# Altium schematic sheet 20.Power_DC IN.SchDoc
size 420 x 297 mm; Revision: V2.1; Schematic Page Number: 11; Page Number: 20; Check: Default; Schematic Name: RK_NVR_DEMO1_RK3588_LP4/4x_V21; Page Count: 43; Page name: 20.Power_DC IN; Designer: Zhangdz; Schematic Page Count: 99; Revcode: V2.1; DsnPath: E:\Work\SBER\RK3588_SOM\temp\RK_NVR_DEMO1_RK3588_LP4XD200P232SD8_V21_20211228.DSN; SchematicName: RK_NVR_DEMO1_RK3588_LP4/4x_V21; PageName: 20.Power_DC IN; PageSize: A3; TopSchematic: True
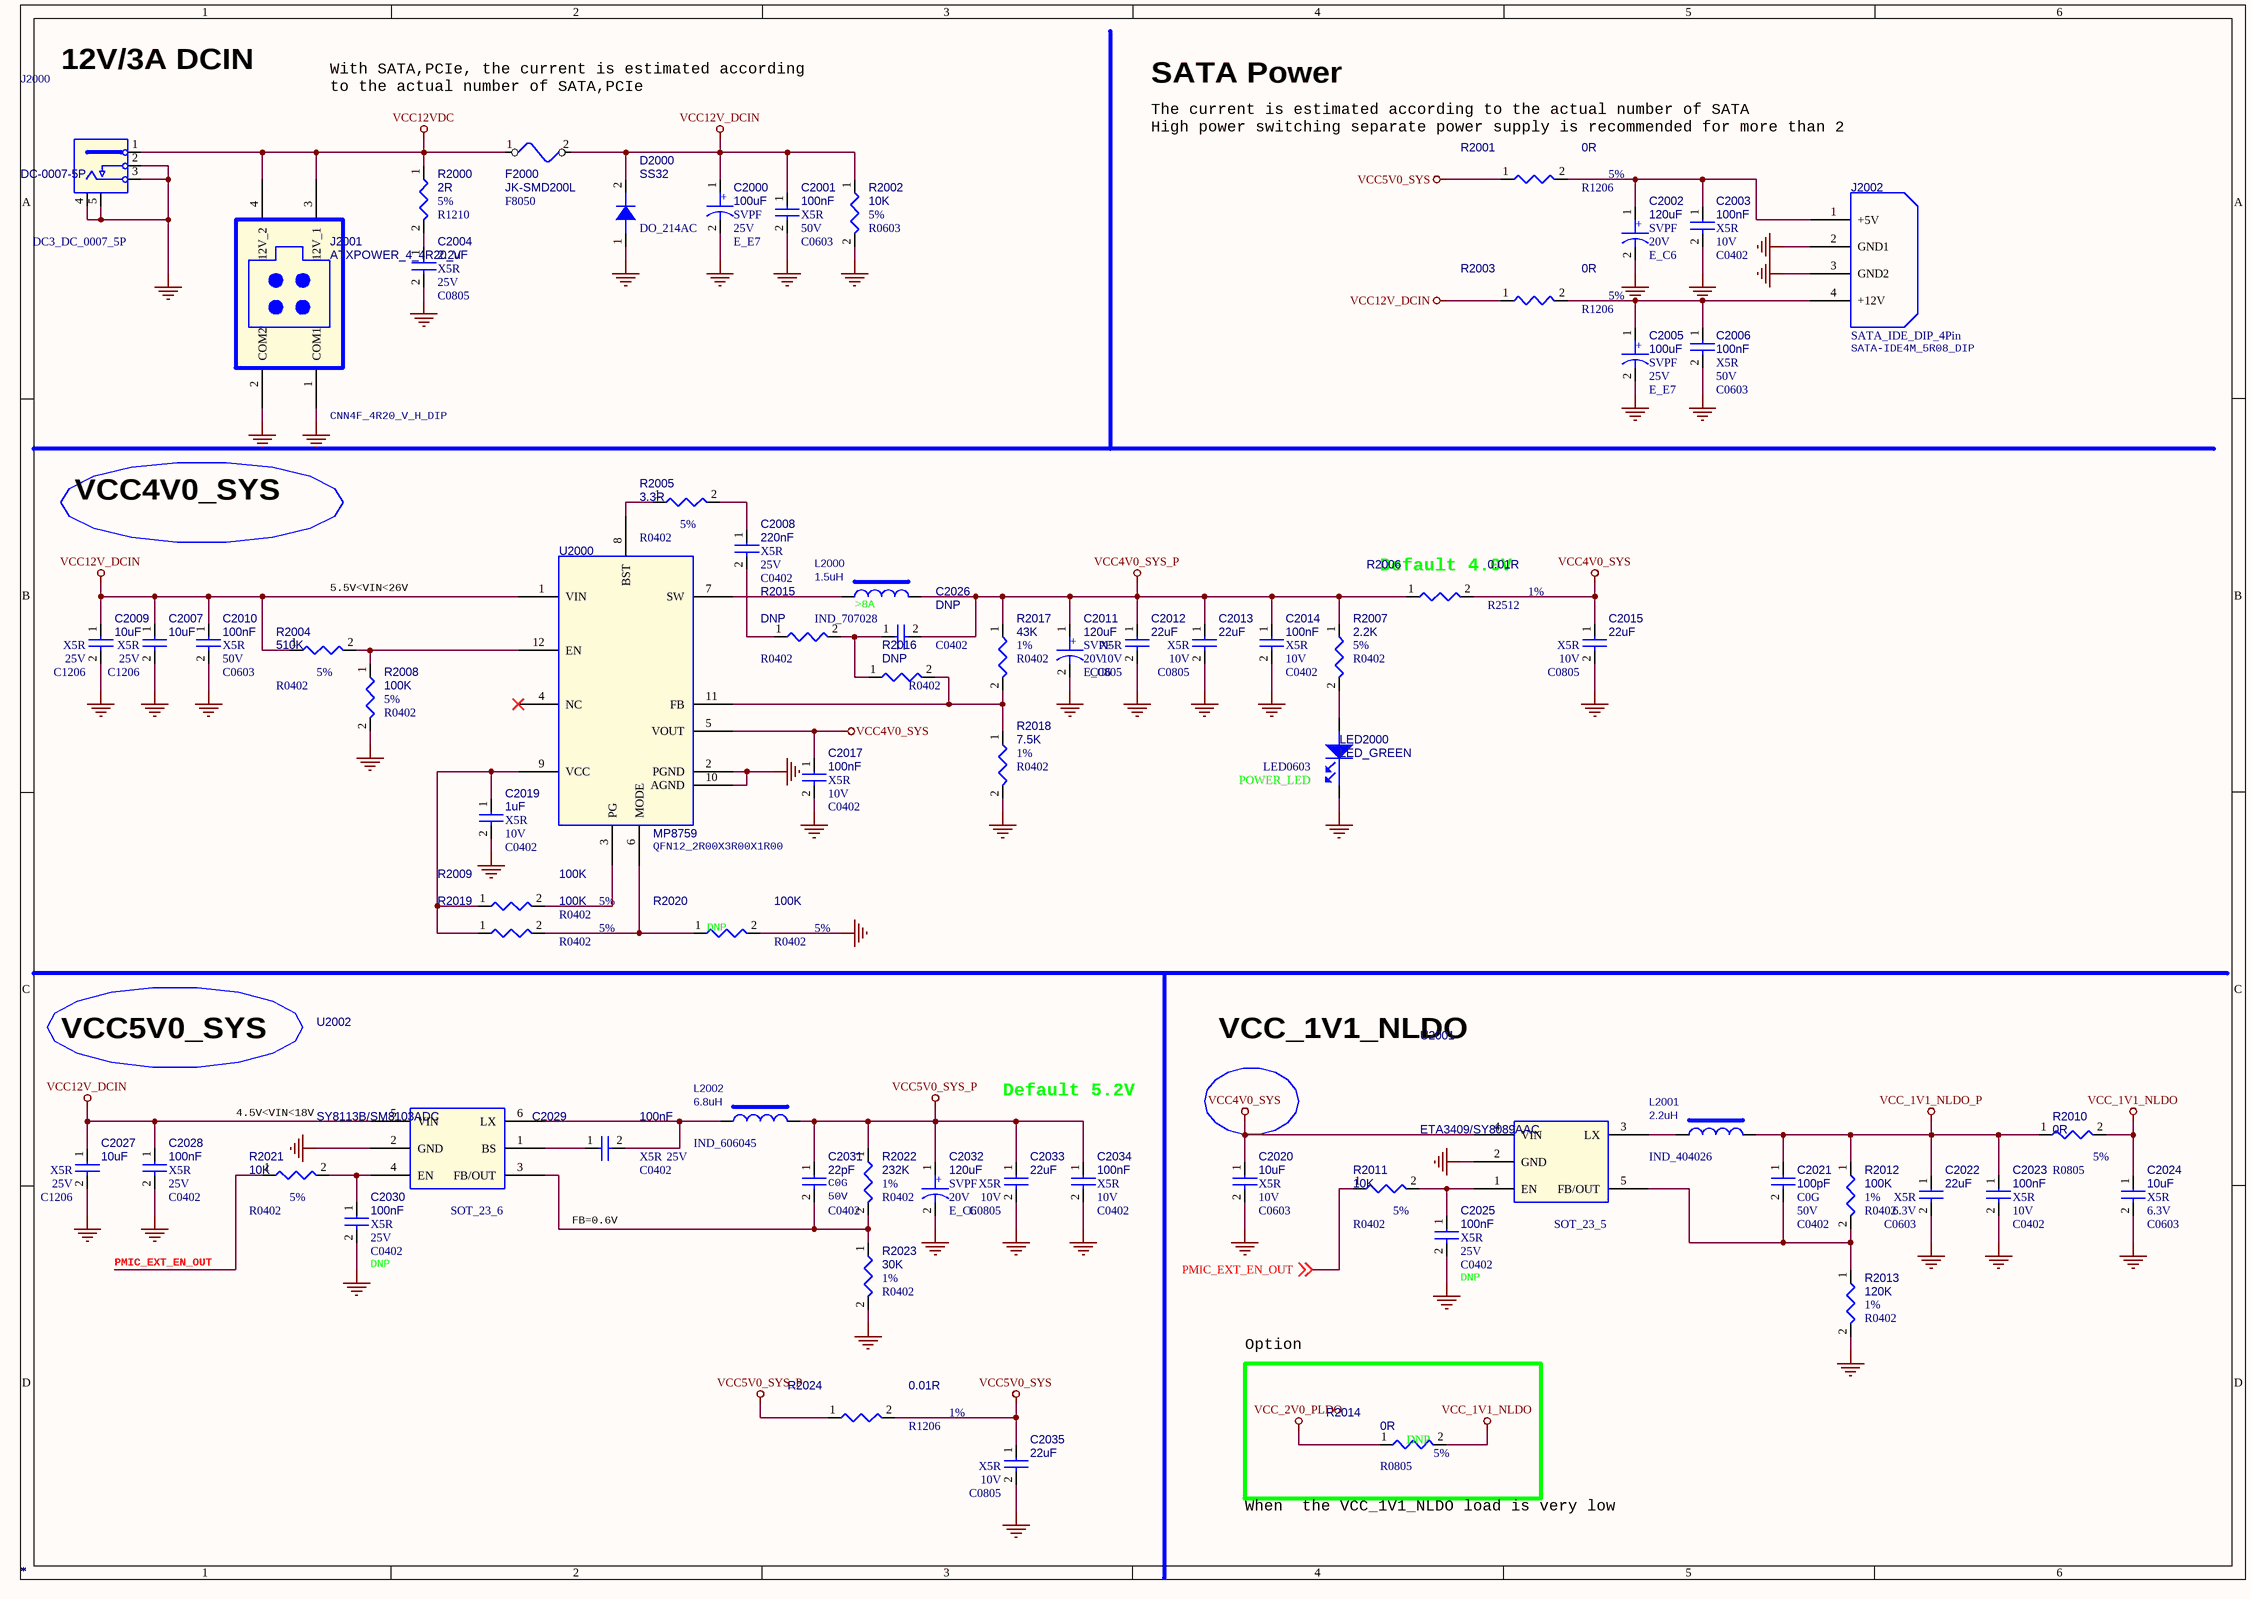
[diagram p0: 20.Power_DC IN.SchDoc]

## Parts
C2000  *  Voltage: 25V  Dielectric: SVPF  [E_E7]
C2001  *  Voltage: 50V  Dielectric: X5R  [C0603]
C2002  *  Voltage: 20V  Dielectric: SVPF  [E_C6]
C2003  *  Voltage: 10V  Dielectric: X5R  [C0402]
C2004  *  Voltage: 25V  Dielectric: X5R  [C0805]
C2005  *  Voltage: 25V  Dielectric: SVPF  [E_E7]
C2006  *  Voltage: 50V  Dielectric: X5R  [C0603]
C2007  *  Voltage: 25V  Dielectric: X5R  [C1206]
C2008  *  Voltage: 25V  Dielectric: X5R  [C0402]
C2009  *  Voltage: 25V  Dielectric: X5R  [C1206]
C2010  *  Voltage: 50V  Dielectric: X5R  [C0603]
C2011  *  Voltage: 20V  Dielectric: SVPF  [E_C6]
C2012  *  Voltage: 10V  Dielectric: X5R  [C0805]
C2013  *  Voltage: 10V  Dielectric: X5R  [C0805]
C2014  *  Voltage: 10V  Dielectric: X5R  [C0402]
C2015  *  Voltage: 10V  Dielectric: X5R  [C0805]
C2017  *  Voltage: 10V  Dielectric: X5R  [C0402]
C2019  *  Voltage: 10V  Dielectric: X5R  [C0402]
C2020  *  Voltage: 10V  Dielectric: X5R  [C0603]
C2021  *  Voltage: 50V  Dielectric: C0G  [C0402]
C2022  *  Voltage: 6.3V  Dielectric: X5R  [C0603]
C2023  *  Voltage: 10V  Dielectric: X5R  [C0402]
C2024  *  Voltage: 6.3V  Dielectric: X5R  [C0603]
C2025  *  Voltage: 25V  Dielectric: X5R  Option: DNP  [C0402]
C2026  *  [C0402]
C2027  *  Voltage: 25V  Dielectric: X5R  [C1206]
C2028  *  Voltage: 25V  Dielectric: X5R  [C0402]
C2029  *  Voltage: 25V  Dielectric: X5R  [C0402]
C2030  *  Voltage: 25V  Dielectric: X5R  Option: DNP  [C0402]
C2031  *  Voltage: 50V  Dielectric: C0G  [C0402]
C2032  *  Voltage: 20V  Dielectric: SVPF  [E_C6]
C2033  *  Voltage: 10V  Dielectric: X5R  [C0805]
C2034  *  Voltage: 10V  Dielectric: X5R  [C0402]
C2035  *  Voltage: 10V  Dielectric: X5R  [C0805]
D2000  *  [DO_214AC]
F2000  *  [F8050]
J2000  *  [DC3_DC_0007_5P]
J2001  *  [CNN4F_4R20_V_H_DIP]
J2002  *  [SATA-IDE4M_5R08_DIP]
L2000  *  Option: >8A  [IND_707028]
L2001  *  [IND_404026]
L2002  *  [IND_606045]
LED2000  *  option: POWER_LED  [LED0603]
R2000  *  PCB Footprint: R1210  Tolerance: 5%  [R0402]
R2001  *  PCB Footprint: R1206  Tolerance: 5%  [R0402]
R2002  *  PCB Footprint: R0603  Tolerance: 5%  [R0402]
R2003  *  PCB Footprint: R1206  Tolerance: 5%  [R0402]
R2004  *  Tolerance: 5%  [R0402]
R2005  *  Tolerance: 5%  [R0402]
R2006  *  PCB Footprint: R2512  Tolerance: 1%  [R0402]
R2007  *  Tolerance: 5%  [R0402]
R2008  *  Tolerance: 5%  [R0402]
R2009  *  Tolerance: 5%  [R0402]
R2010  *  PCB Footprint: R0805  Tolerance: 5%  [R0402]
R2011  *  Tolerance: 5%  [R0402]
R2012  *  Tolerance: 1%  [R0402]
R2013  *  Tolerance: 1%  [R0402]
R2014  *  PCB Footprint: R0805  Tolerance: 5%  Option: DNP  [R0402]
R2015  *  [R0402]
R2016  *  [R0402]
R2017  *  Tolerance: 1%  [R0402]
R2018  *  Tolerance: 1%  [R0402]
R2019  *  Tolerance: 5%  [R0402]
R2020  *  Tolerance: 5%  Option: DNP  [R0402]
R2021  *  Tolerance: 5%  [R0402]
R2022  *  Tolerance: 1%  [R0402]
R2023  *  Tolerance: 1%  [R0402]
R2024  *  PCB Footprint: R1206  Tolerance: 1%  [R0402]
U2000  *  [QFN12_2R00X3R00X1R00]
U2001  *  [SOT_23_5]
U2002  *  [SOT_23_6]

## Blocks framed on the sheet
Option: R2014

## Nets
GND: C2000.2 C2001.2 C2002.2 C2003.2 C2004.2 C2005.2 C2006.2 C2007.2 C2009.2 C2010.2 C2011.2 C2012.2 C2013.2 C2014.2 C2015.2 C2017.2 C2019.2 C2020.2 C2022.2 C2023.2 C2024.2 C2025.2 C2027.2 C2028.2 C2030.2 C2032.2 C2033.2 C2034.2 C2035.2 D2000.1(A) J2000.2 J2000.3 J2000.4 J2000.5 J2001.1(COM1) J2001.2(COM2) J2002.2(GND1) J2002.3(GND2) LED2000.2(CATHODE) R2002.2 R2008.2 R2013.2 R2018.2 R2020.2 R2023.2 U2000.2(PGND) U2000.10(AGND) U2001.2(GND) U2002.2(GND)
VCC4V0_SYS: C2015.1 C2017.1 C2020.1 R2006.2 U2000.5(VOUT) U2001.4(VIN)
VCC4V0_SYS_P: C2011.1 C2012.1 C2013.1 C2014.1 C2026.2 L2000.2 R2006.1 R2007.1 R2017.1
VCC5V0_SYS: C2035.1 R2001.1 R2024.2
VCC5V0_SYS_P: C2031.1 C2032.1 C2033.1 C2034.1 L2002.2 R2022.1 R2024.1
VCC12V_DCIN: C2000.1 C2001.1 C2007.1 C2009.1 C2010.1 C2027.1 C2028.1 D2000.2(K) F2000.2 R2002.1 R2003.1 R2004.1 U2000.1(VIN) U2002.5(VIN)
VCC12VDC: F2000.1 J2000.1 J2001.3(12V_1) J2001.4(12V_2) R2000.1
VCC_1V1_NLDO: C2024.1 R2010.2 R2014.2
VCC_1V1_NLDO_P: C2021.1 C2022.1 C2023.1 L2001.2 R2010.1 R2012.1
VCC_2V0_PLDO: R2014.1
PMIC_EXT_EN_OUT: R2011.1 R2021.1 ; off-sheet PMIC_EXT_EN_OUT
NetC2002_1: C2002.1 C2003.1 J2002.1(+5V) R2001.2
NetC2004_1: C2004.1 R2000.2
NetC2005_1: C2005.1 C2006.1 J2002.4(+12V) R2003.2
NetC2008_1: C2008.1 R2005.2
NetC2008_2: C2008.2 R2015.1
NetC2019_1: C2019.1 R2009.1 R2019.1 U2000.9(VCC)
NetC2021_2: C2021.2 R2012.2 R2013.1 U2001.5(FB/OUT)
NetC2025_1: C2025.1 R2011.2 U2001.1(EN)
NetC2026_1: C2026.1 R2015.2 R2016.1
NetC2029_1: C2029.1 U2002.1(BS)
NetC2029_2: C2029.2 L2002.1 U2002.6(LX)
NetC2030_1: C2030.1 R2021.2 U2002.4(EN)
NetC2031_2: C2031.2 R2022.2 R2023.1 U2002.3(FB/OUT)
NetL2000_1: L2000.1 U2000.7(SW)
NetL2001_1: L2001.1 U2001.3(LX)
NetLED2000_1: LED2000.1(ANODE) R2007.2
NetR2004_2: R2004.2 R2008.1 U2000.12(EN)
NetR2005_1: R2005.1 U2000.8(BST)
NetR2009_2: R2009.2 U2000.3(PG)
NetR2016_2: R2016.2 R2017.2 R2018.1 U2000.11(FB)
NetR2019_2: R2019.2 R2020.1 U2000.6(MODE)

Not connected (* = marked no-connect by the designer): U2000 4(NC)*

## Notes on the sheet
- 12V/3A DCIN
- With SATA,PCIe, the current is estimated according
  to the actual number of SATA,PCIe
- SATA Power
- (near R2001) The current is estimated according to the actual number of SATA
  High power switching separate power supply is recommended for more than 2
- VCC4V0_SYS
- 5.5V<VIN<26V
- (near R2006) Default 4.0V
- VCC5V0_SYS
- VCC_1V1_NLDO
- 4.5V<VIN<18V
- Default 5.2V
- FB=0.6V
- When  the VCC_1V1_NLDO load is very low
- (in symbol CAP) +

## Library data of the parts
C2000 = CAP: 100uF,25V,24mR,SVPF; Part Reference: C2000; Manufacturer: Panasonic; RK PN: 25SVPF100M; Priority: A; Tolerance: 20%; PCB Footprint: E_E7; Value: 100uF; Part Type: МщЖ¬№ММ¬ВБµзЅв; Manufacturer PN: 25SVPF100M; Created by: JJJ
C2001 = CAP NP: cap,100.00nF,+/-10%,50V,X5R,C0603; Part Reference: C2001; Manufacturer PN: C1608X5R1H104K080AA; Manufacturer: TDK; Value: 100nF; Tolerance: 10%; Priority: A; PCB Footprint: C0603; Created by: JJJ; Part Type: C0603; RK PN: C1608X5R1H104K080AA
C2002 = CAP: 120uF,20V,25mR,SVPF; Part Reference: C2002; Manufacturer PN: 25SVPF100M; Manufacturer: Panasonic; Tolerance: 20%; Priority: A; PCB Footprint: E_C6; Value: 120uF; Created by: JJJ; Part Type: МщЖ¬№ММ¬ВБµзЅв; RK PN: 25SVPF100M
C2003 = CAP NP: cap,100.00nF,+/-10%,10V,X5R,C0402; Part Reference: C2003; Manufacturer: TDK; Value: 100nF; Number: 37; RK PN: C1005X5R1A104K050BA; Priority: A; Tolerance: 10%; C_Voltage: 6.3V; PCB Footprint: C0402; Part Type: C0402; Manufacturer PN: C1005X5R1A104K050BA; Created by: JJJ
C2004 = CAP NP: cap,2.20uF,+/-10%,25V,X5R,C0805; Part Reference: C2004; Manufacturer: TDK; Value: 2.2uF; RK PN: C2012X5R1E225K085AC; Priority: A; Tolerance: 10%; PCB Footprint: C0805; Part Type: C0805; Manufacturer PN: C2012X5R1E225K085AC; Created by: JJJ
C2005 = CAP: 100uF,25V,24mR,SVPF; Part Reference: C2005; Manufacturer PN: 25SVPF100M; Manufacturer: Panasonic; Tolerance: 20%; Priority: A; PCB Footprint: E_E7; Value: 100uF; Created by: JJJ; Part Type: МщЖ¬№ММ¬ВБµзЅв; RK PN: 25SVPF100M
C2006 = CAP NP: cap,100.00nF,+/-10%,50V,X5R,C0603; Part Reference: C2006; Manufacturer PN: C1608X5R1H104K080AA; Manufacturer: TDK; Value: 100nF; Tolerance: 10%; Priority: A; PCB Footprint: C0603; Created by: JJJ; Part Type: C0603; RK PN: C1608X5R1H104K080AA
C2007 = CAP NP: cap,10.00uF,+/-10%,25V,X5R,C1206; Part Reference: C2007; Manufacturer PN: C3216X5R1E106K085AC; Manufacturer: TDK; Value: 10uF; Tolerance: 10%; C_Voltage: 6.3V; Priority: A; PCB Footprint: C1206; Created by: JJJ; Part Type: C1206; RK PN: C3216X5R1E106K085AC
C2008 = CAP NP: cap,220.00nF,+/-10%,25V,X5R,C0402; Part Reference: C2008; Manufacturer PN: C1005X5R1E224K050BC; Manufacturer: TDK; Value: 220nF; C_Voltage: 6.3V; Tolerance: 10%; Priority: A; Number: 37; PCB Footprint: C0402; Created by: JJJ; Part Type: C0402; RK PN: C1005X5R1E224K050BC
C2009 = CAP NP: cap,10.00uF,+/-10%,25V,X5R,C1206; Part Reference: C2009; Manufacturer PN: C3216X5R1E106K085AC; Manufacturer: TDK; Value: 10uF; Tolerance: 10%; C_Voltage: 6.3V; Priority: A; PCB Footprint: C1206; Created by: JJJ; Part Type: C1206; RK PN: C3216X5R1E106K085AC
C2010 = CAP NP: cap,100.00nF,+/-10%,50V,X5R,C0603; Part Reference: C2010; Manufacturer PN: C1608X5R1H104K080AA; Manufacturer: TDK; Value: 100nF; Tolerance: 10%; Priority: A; PCB Footprint: C0603; Created by: JJJ; Part Type: C0603; RK PN: C1608X5R1H104K080AA
C2011 = CAP: 120uF,20V,25mR,SVPF; Part Reference: C2011; Manufacturer PN: 25SVPF100M; Manufacturer: Panasonic; Tolerance: 20%; Priority: A; PCB Footprint: E_C6; Value: 120uF; Created by: JJJ; Part Type: МщЖ¬№ММ¬ВБµзЅв; RK PN: 25SVPF100M
C2012 = CAP NP: cap,22.00uF,+/-10%,10V,X5R,C0805; Part Reference: C2012; Manufacturer: TDK; Value: 22uF; RK PN: C2012X5R1A226K125AB; Priority: A; C_Voltage: 6.3V; Tolerance: 10%; PCB Footprint: C0805; Part Type: C0805; Manufacturer PN: C2012X5R1A226K125AB; Created by: JJJ
C2013 = CAP NP: cap,22.00uF,+/-10%,10V,X5R,C0805; Part Reference: C2013; Manufacturer PN: C2012X5R1A226K125AB; Manufacturer: TDK; Value: 22uF; Tolerance: 10%; C_Voltage: 6.3V; Priority: A; PCB Footprint: C0805; Created by: JJJ; Part Type: C0805; RK PN: C2012X5R1A226K125AB
C2014 = CAP NP: cap,100.00nF,+/-10%,10V,X5R,C0402; Part Reference: C2014; Manufacturer PN: C1005X5R1A104K050BA; Manufacturer: TDK; Value: 100nF; C_Voltage: 6.3V; Tolerance: 10%; Priority: A; Number: 37; PCB Footprint: C0402; Created by: JJJ; Part Type: C0402; RK PN: C1005X5R1A104K050BA
C2015 = CAP NP: cap,22.00uF,+/-10%,10V,X5R,C0805; Part Reference: C2015; Manufacturer PN: C2012X5R1A226K125AB; Manufacturer: TDK; Value: 22uF; Tolerance: 10%; C_Voltage: 6.3V; Priority: A; PCB Footprint: C0805; Created by: JJJ; Part Type: C0805; RK PN: C2012X5R1A226K125AB
C2017 = CAP NP: cap,100.00nF,+/-10%,10V,X5R,C0402; Part Reference: C2017; Manufacturer: TDK; Value: 100nF; Number: 37; RK PN: C1005X5R1A104K050BA; Priority: A; Tolerance: 10%; C_Voltage: 6.3V; PCB Footprint: C0402; Part Type: C0402; Manufacturer PN: C1005X5R1A104K050BA; Created by: JJJ
C2019 = CAP NP: cap,1.00uF,+/-10%,10V,X5R,C0402; Part Reference: C2019; Manufacturer PN: C1005X5R1A105K050BB; Manufacturer: TDK; Value: 1uF; C_Voltage: 6.3V; Tolerance: 10%; Priority: A; Number: 37; PCB Footprint: C0402; Created by: JJJ; Part Type: C0402; RK PN: C1005X5R1A105K050BB
C2020 = CAP NP: cap,10.00uF,+/-10%,10V,X5R,C0603; Part Reference: C2020; Manufacturer PN: C1608X5R1A106K080AC; Manufacturer: TDK; Value: 10uF; Tolerance: 10%; Priority: A; PCB Footprint: C0603; Created by: JJJ; Part Type: C0603; RK PN: C1608X5R1A106K080AC
C2021 = CAP NP: cap,100.00pF,+/-10%,50V,C0G,C0402; Part Reference: C2021; Manufacturer PN: C1005C0G1H101K050BA; Manufacturer: TDK; Value: 100pF; Tolerance: 10%; Priority: A; PCB Footprint: C0402; Created by: JJJ; Part Type: C0402; RK PN: C1005C0G1H101K050BA
C2022 = CAP NP: cap,22.00uF,+/-20%,6.3V,X5R,C0603; Part Reference: C2022; Manufacturer: TDK; Value: 22uF; RK PN: C1608X5R0J226M080AC; Priority: A; Tolerance: 20%; PCB Footprint: C0603; Part Type: C0603; C_Voltage: 6.3V; Manufacturer PN: C1608X5R0J226M080AC; Created by: JJJ
C2023 = CAP NP: cap,100.00nF,+/-10%,10V,X5R,C0402; Part Reference: C2023; Manufacturer PN: C1005X5R1A104K050BA; Manufacturer: TDK; Value: 100nF; C_Voltage: 6.3V; Tolerance: 10%; Priority: A; Number: 37; PCB Footprint: C0402; Created by: JJJ; Part Type: C0402; RK PN: C1005X5R1A104K050BA
C2024 = CAP NP: cap,10.00uF,+/-10%,6.3V,X5R,C0603; Part Reference: C2024; Manufacturer PN: C1608X5R0J106K080AB; Manufacturer: TDK; Value: 10uF; Tolerance: 10%; Priority: A; PCB Footprint: C0603; Created by: JJJ; C_Voltage: 6.3V; Part Type: C0603; RK PN: C1608X5R0J106K080AB
C2025 = CAP NP: cap,100.00nF,+/-10%,25V,X5R,C0402; Part Reference: C2025; Manufacturer: TDK; Value: 100nF; Number: 37; RK PN: C1005X5R1E104K050BC; Priority: A; Tolerance: 10%; C_Voltage: 6.3V; PCB Footprint: C0402; Part Type: C0402; Manufacturer PN: C1005X5R1E104K050BC; Created by: JJJ
C2026 = CAP NP: Did Not Place.; Part Reference: C2026; Value: DNP; Number: 37; RK PN: DNPC0402; Priority: A; C_Voltage: 6.3V; PCB Footprint: C0402; Part Type: DNP; Manufacturer PN: DNPC0402; Created by: JJJ
C2027 = CAP NP: cap,10.00uF,+/-10%,25V,X5R,C1206; Part Reference: C2027; Manufacturer: TDK; Value: 10uF; RK PN: C3216X5R1E106K085AC; Priority: A; C_Voltage: 6.3V; Tolerance: 10%; PCB Footprint: C1206; Part Type: C1206; Manufacturer PN: C3216X5R1E106K085AC; Created by: JJJ
C2028 = CAP NP: cap,100.00nF,+/-10%,25V,X5R,C0402; Part Reference: C2028; Manufacturer PN: C1005X5R1E104K050BC; Manufacturer: TDK; Value: 100nF; Tolerance: 10%; Priority: A; PCB Footprint: C0402; Created by: JJJ; Part Type: C0402; RK PN: C1005X5R1E104K050BC
C2029 = CAP NP: cap,100.00nF,+/-10%,25V,X5R,C0402; Part Reference: C2029; Manufacturer PN: C1005X5R1E104K050BC; Manufacturer: TDK; Value: 100nF; C_Voltage: 6.3V; Tolerance: 10%; Priority: A; Number: 37; PCB Footprint: C0402; Created by: JJJ; Part Type: C0402; RK PN: C1005X5R1E104K050BC
C2030 = CAP NP: cap,100.00nF,+/-10%,25V,X5R,C0402; Part Reference: C2030; Manufacturer: TDK; Value: 100nF; Number: 37; RK PN: C1005X5R1E104K050BC; Priority: A; Tolerance: 10%; C_Voltage: 6.3V; PCB Footprint: C0402; Part Type: C0402; Manufacturer PN: C1005X5R1E104K050BC; Created by: JJJ
C2031 = CAP NP: cap,22.00pF,+/-5%,50V,C0G,C0402; Part Reference: C2031; Manufacturer: TDK; Value: 22pF; RK PN: C1005C0G1H220J050BA; Priority: A; Tolerance: 5%; PCB Footprint: C0402; Part Type: C0402; Manufacturer PN: C1005C0G1H220J050BA; Created by: JJJ
C2032 = CAP: 120uF,20V,25mR,SVPF; Part Reference: C2032; Manufacturer: Panasonic; RK PN: 25SVPF100M; Priority: A; Tolerance: 20%; PCB Footprint: E_C6; Value: 120uF; Part Type: МщЖ¬№ММ¬ВБµзЅв; Manufacturer PN: 25SVPF100M; Created by: JJJ
C2033 = CAP NP: cap,22.00uF,+/-10%,10V,X5R,C0805; Part Reference: C2033; Manufacturer: TDK; Value: 22uF; RK PN: C2012X5R1A226K125AB; Priority: A; C_Voltage: 6.3V; Tolerance: 10%; PCB Footprint: C0805; Part Type: C0805; Manufacturer PN: C2012X5R1A226K125AB; Created by: JJJ
C2034 = CAP NP: cap,100.00nF,+/-10%,10V,X5R,C0402; Part Reference: C2034; Manufacturer: TDK; Value: 100nF; Number: 37; RK PN: C1005X5R1A104K050BA; Priority: A; Tolerance: 10%; C_Voltage: 6.3V; PCB Footprint: C0402; Part Type: C0402; Manufacturer PN: C1005X5R1A104K050BA; Created by: JJJ
C2035 = CAP NP: cap,22.00uF,+/-10%,10V,X5R,C0805; Part Reference: C2035; Manufacturer: TDK; Value: 22uF; RK PN: C2012X5R1A226K125AB; Priority: A; C_Voltage: 6.3V; Tolerance: 10%; PCB Footprint: C0805; Part Type: C0805; Manufacturer PN: C2012X5R1A226K125AB; Created by: JJJ
D2000 = DIODE: Schottky BarrierЈ¬SS32 DO214AC; Part Reference: D2000; Manufacturer: РЗєЈ; Value: SS32; Priority: A; PCB Footprint: DO_214AC; Created by: JJJ; Manufacturer PN: SS32; Part Type: Schottky rectifier; RK PN: SS32
F2000 = FUSE: ±ЈПХЛїЈ¬Vmax=16V,Imax=100AЈ¬Icurrent=8A,Ri=0.028ohm; Part Reference: F2000; Manufacturer: ЅрИрµзЧУ; Value: JK-SMD200L; RK PN: Q/JKTD-16-200; Priority: A; PCB Footprint: F8050; Part Type: FUSE; Manufacturer Part Number: Q/JKTD-16-200; Created by: JJJ
J2000 = DCJACK_3P: DCЧщ; Part Reference: J2000; Manufacturer: НъїЖґп; Value: DC-0007-5P; Priority: A; PCB Footprint: DC3_DC_0007_5P; RK PN: DC-0007-5P; Part Type: POWER Jack; Manufacturer Part Number: DC-0007-5P; Created by: JJJ
J2001 = CON4_8: Part Reference: J2001; Value: ATXPOWER_4_4R20_V; PCB Footprint: CNN4F_4R20_V_H_DIP
J2002 = SATA_IDE_DIP_0: Part Reference: J2002; Value: SATA_IDE_DIP_4Pin; PCB Footprint: SATA-IDE4M_5R08_DIP
L2000 = INDUCTORS OF FERRITE_Dup1: Power Inductor,1.5uH,MWSA0603S-1R5MT; Part Reference: L2000; Manufacturer: Vishay; Isat: 9.6A; Priority: A; Tolerance: 20%; Irms: 10.5A; PCB Footprint: IND_707028; Value: 1.5uH; Part Type: IND; Created by: JJJ
L2001 = INDUCTORS OF FERRITE_Dup1: Power Inductor,2.2uH,0.2,IND_404026; Part Reference: L2001; Manufacturer PN: SWPA4026S2R2MT; Manufacturer: sunlord; Isat: 2.10A; DC Resistor: 0.04ohm; Resonace frequency: 96M; Irms: 2A; Tolerance: 20%; Priority: A; PCB Footprint: IND_404026; Value: 2.2uH; Created by: YTL; Part Type: POWER_IND; RK PN: SWPA4026S2R2MT
L2002 = INDUCTORS OF FERRITE_Dup1: Power Inductor,6.8uH,0.031,IND_606045; Part Reference: L2002; Manufacturer: sunlord; Isat: 3.9A; DC Resistor: 0.031ohm; RK PN: SWPA6045S4R7MT; Priority: A; Tolerance: 20%; Irms: 3.0A; Resonace frequency: 24M; PCB Footprint: IND_606045; Value: 6.8uH; Part Type: POWER_IND; Manufacturer PN: SWPA6045S4R7MT; Created by: YWQ
LED2000 = LED: МщЖ¬LEDµЖЈ¬0603Ј¬ВМЙ«; Part Reference: LED2000; Value: LED_GREEN; Priority: A; PCB Footprint: LED0603; RK PN: LED_GREEN; Part Type: LED; Created by: JJJ
R2000 = RESISTOR_Dup1: НЁУГєсД¤µзЧи,2R,+/-5%,R1210,1/2W.; Part Reference: R2000; Manufacturer: YAGEO; RK PN: RC1210JR-072RL; Priority: A; Wattage: 1/2W; Value: 2R; Part Type: НЁУГєсД¤µзЧи; Manufacturer PN: RC1210JR-072RL; Created by: YTL
R2001 = RESISTOR_Dup1: НЁУГєсД¤µзЧи,0R,+/-5%,R1206,1/4W.; Part Reference: R2001; Manufacturer: YAGEO; RK PN: RC1206JR-070RL; Priority: A; Wattage: 1/4W; Value: 0R; Part Type: НЁУГєсД¤µзЧи; Manufacturer PN: RC1206JR-070RL; Created by: YTL
R2002 = RESISTOR_Dup1: НЁУГєсД¤µзЧи,10K,+/-5%,R0603,1/10W.; Part Reference: R2002; Manufacturer PN: RC0603JR-0710KL; Manufacturer: YAGEO; Wattage: 1/10W; Priority: A; Value: 10K; Created by: YTL; Part Type: НЁУГєсД¤µзЧи; RK PN: RC0603JR-0710KL
R2003 = RESISTOR_Dup1: НЁУГєсД¤µзЧи,0R,+/-5%,R1206,1/4W.; Part Reference: R2003; Manufacturer: YAGEO; RK PN: RC1206JR-070RL; Priority: A; Wattage: 1/4W; Value: 0R; Part Type: НЁУГєсД¤µзЧи; Manufacturer PN: RC1206JR-070RL; Created by: YTL
R2004 = RESISTOR_Dup1: НЁУГєсД¤µзЧи,510K,+/-5%,R0402,1/16W.; Part Reference: R2004; Manufacturer PN: RC0402JR-07510KL; Manufacturer: YAGEO; Wattage: 1/16W; Priority: A; PCB Footprint: R0402; Value: 510K; Created by: YTL; Part Type: НЁУГєсД¤µзЧи; RK PN: RC0402JR-07510KL
R2005 = RESISTOR_Dup1: НЁУГєсД¤µзЧи,3R3,+/-5%,R0402,1/16W.; Part Reference: R2005; Manufacturer: YAGEO; Value: 3.3R; RK PN: RC0402JR-073R3L; Priority: A; Wattage: 1/16W; PCB Footprint: R0402; Part Type: НЁУГєсД¤µзЧи; Manufacturer PN: RC0402JR-073R3L; Created by: YTL
R2006 = RESISTOR_Dup1: єсД¤µНЧиЦµµзЧи,0R01,+/-1%,R2512,1W.; Part Reference: R2006; Manufacturer: YAGEO; Value: 0.01R; RK PN: RL2512FK-070R012L; Priority: A; Wattage: 1W; Part Type: єсД¤µНЧиЦµµзЧи; Manufacturer PN: RL2512FK-070R012L; Created by: YTL
R2007 = RESISTOR_Dup1: НЁУГєсД¤µзЧи,2K2,+/-5%,R0402,1/16W.; Part Reference: R2007; Manufacturer: YAGEO; Value: 2.2K; RK PN: RC0402JR-072K2L; Priority: A; Wattage: 1/16W; PCB Footprint: R0402; Part Type: НЁУГєсД¤µзЧи; Manufacturer PN: RC0402JR-072K2L; Created by: YTL
R2008 = RESISTOR_Dup1: НЁУГєсД¤µзЧи,100K,+/-5%,R0402,1/16W.; Part Reference: R2008; Manufacturer PN: RC0402JR-07100KL; Manufacturer: YAGEO; Wattage: 1/16W; Priority: A; PCB Footprint: R0402; Value: 100K; Created by: YTL; Part Type: НЁУГєсД¤µзЧи; RK PN: RC0402JR-07100KL
R2009 = RESISTOR_Dup1: НЁУГєсД¤µзЧи,100K,+/-5%,R0402,1/16W.; Part Reference: R2009; Manufacturer: YAGEO; RK PN: RC0402JR-07100KL; Priority: A; Wattage: 1/16W; PCB Footprint: R0402; Value: 100K; Part Type: НЁУГєсД¤µзЧи; Manufacturer PN: RC0402JR-07100KL; Created by: YTL
R2010 = RESISTOR_Dup1: НЁУГєсД¤µзЧи,0R,+/-5%,R0805,1/8W.; Part Reference: R2010; Manufacturer: YAGEO; RK PN: RC0805JR-070RL; Priority: A; Wattage: 1/8W; Value: 0R; Part Type: НЁУГєсД¤µзЧи; Manufacturer PN: RC0805JR-070RL; Created by: YTL
R2011 = RESISTOR_Dup1: НЁУГєсД¤µзЧи,10K,+/-5%,R0402,1/16W.; Part Reference: R2011; Manufacturer: YAGEO; RK PN: RC0402JR-0710KL; Priority: A; Wattage: 1/16W; PCB Footprint: R0402; Value: 10K; Part Type: НЁУГєсД¤µзЧи; Manufacturer PN: RC0402JR-0710KL; Created by: YTL
R2012 = RESISTOR_Dup1: НЁУГєсД¤µзЧи,100K,+/-1%,R0402,1/16W.; Part Reference: R2012; Manufacturer PN: RC0402FR-07100KL; Manufacturer: YAGEO; Wattage: 1/16W; Priority: A; PCB Footprint: R0402; Value: 100K; Created by: YTL; Part Type: НЁУГєсД¤µзЧи; RK PN: RC0402FR-07100KL
R2013 = RESISTOR_Dup1: НЁУГєсД¤µзЧи,120K,+/-1%,R0402,1/16W.; Part Reference: R2013; Manufacturer PN: RC0402FR-07120KL; Manufacturer: YAGEO; Wattage: 1/16W; Priority: A; PCB Footprint: R0402; Value: 120K; Created by: YTL; Part Type: НЁУГєсД¤µзЧи; RK PN: RC0402FR-07120KL
R2014 = RESISTOR_Dup1: НЁУГєсД¤µзЧи,0R,+/-5%,R0805,1/8W.; Part Reference: R2014; Manufacturer PN: RC0805JR-070RL; Manufacturer: YAGEO; Wattage: 1/8W; Priority: A; Value: 0R; Created by: YTL; Part Type: НЁУГєсД¤µзЧи; RK PN: RC0805JR-070RL
R2015 = RESISTOR_Dup1: Did Not Place.; Part Reference: R2015; Value: DNP; RK PN: DNPR0402; Priority: A; PCB Footprint: R0402; Part Type: DNP; Manufacturer PN: DNPR0402; Created by: JJJ
R2016 = RESISTOR_Dup1: Did Not Place.; Part Reference: R2016; Manufacturer PN: DNPR0402; Value: DNP; Priority: A; PCB Footprint: R0402; Created by: JJJ; Part Type: DNP; RK PN: DNPR0402
R2017 = RESISTOR_Dup1: НЁУГєсД¤µзЧи,43K,+/-1%,R0402,1/16W.; Part Reference: R2017; Manufacturer PN: RC0402FR-0743KL; Manufacturer: YAGEO; Wattage: 1/16W; Priority: A; PCB Footprint: R0402; Value: 43K; Created by: YTL; Part Type: НЁУГєсД¤µзЧи; RK PN: RC0402FR-0743KL
R2018 = RESISTOR_Dup1: НЁУГєсД¤µзЧи,7K5,+/-1%,R0402,1/16W.; Part Reference: R2018; Manufacturer PN: RC0402FR-077K5L; Manufacturer: YAGEO; Value: 7.5K; Wattage: 1/16W; Priority: A; PCB Footprint: R0402; Created by: YTL; Part Type: НЁУГєсД¤µзЧи; RK PN: RC0402FR-077K5L
R2019 = RESISTOR_Dup1: НЁУГєсД¤µзЧи,100K,+/-5%,R0402,1/16W.; Part Reference: R2019; Manufacturer PN: RC0402JR-07100KL; Manufacturer: YAGEO; Wattage: 1/16W; Priority: A; PCB Footprint: R0402; Value: 100K; Created by: YTL; Part Type: НЁУГєсД¤µзЧи; RK PN: RC0402JR-07100KL
R2020 = RESISTOR_Dup1: НЁУГєсД¤µзЧи,100K,+/-5%,R0402,1/16W.; Part Reference: R2020; Manufacturer PN: RC0402JR-07100KL; Manufacturer: YAGEO; Wattage: 1/16W; Priority: A; PCB Footprint: R0402; Value: 100K; Created by: YTL; Part Type: НЁУГєсД¤µзЧи; RK PN: RC0402JR-07100KL
R2021 = RESISTOR_Dup1: НЁУГєсД¤µзЧи,10K,+/-5%,R0402,1/16W.; Part Reference: R2021; Manufacturer: YAGEO; RK PN: RC0402JR-0710KL; Priority: A; Wattage: 1/16W; PCB Footprint: R0402; Value: 10K; Part Type: НЁУГєсД¤µзЧи; Manufacturer PN: RC0402JR-0710KL; Created by: YTL
R2022 = RESISTOR_Dup1: НЁУГєсД¤µзЧи,232K,+/-1%,R0402,1/16W.; Part Reference: R2022; Manufacturer: YAGEO; RK PN: RC0402FR-07232KL; Priority: A; Wattage: 1/16W; PCB Footprint: R0402; Value: 232K; Part Type: НЁУГєсД¤µзЧи; Manufacturer PN: RC0402FR-07232KL; Created by: YTL
R2023 = RESISTOR_Dup1: НЁУГєсД¤µзЧи,30K,+/-1%,R0402,1/16W.; Part Reference: R2023; Manufacturer PN: RC0402FR-0730KL; Manufacturer: YAGEO; Wattage: 1/16W; Priority: A; PCB Footprint: R0402; Value: 30K; Created by: YTL; Part Type: НЁУГєсД¤µзЧи; RK PN: RC0402FR-0730KL
R2024 = RESISTOR_Dup1: єсД¤µНЧиЦµµзЧи,0R01,+/-1%,R1206,1/2W.; Part Reference: R2024; Manufacturer PN: RL1206FR-7W0R01L; Manufacturer: YAGEO; Value: 0.01R; Wattage: 1/2W; Priority: A; Created by: YTL; Part Type: єсД¤µНЧиЦµµзЧи; RK PN: RL1206FR-7W0R01L
U2000 = MP8759_6: Part Reference: U2000; Value: MP8759; PCB Footprint: QFN12_2R00X3R00X1R00
U2001 = DCDC_SY8088: High Efficiency 5.5V, 2A continuous, 3A peak, 1MHz Synchronous Step Down Regulator; Part Reference: U2001; Manufacturer PN: SY8089AAC; Manufacturer: SilergyЈЁОщБ¦ЅЬЈ©; Value: ETA3409/SY8089AAC; Priority: A; PCB Footprint: SOT_23_5; Created by: JJJ; Part Type: DCDC; RK PN: SY8089AAC
U2002 = DCDC_SY8113: Part Reference: U2002; Manufacturer PN: SY8113B; Manufacturer: SilergyЈЁОщБ¦ЅЬЈ©; Value: SY8113B/SM8103ADC; Priority: A; PCB Footprint: SOT_23_6; Created by: JJJ; Part Type: DCDC; RK PN: SY8113B